# EAGLE schematic M466-compressor-limiter (EAGLE 7.2.0)
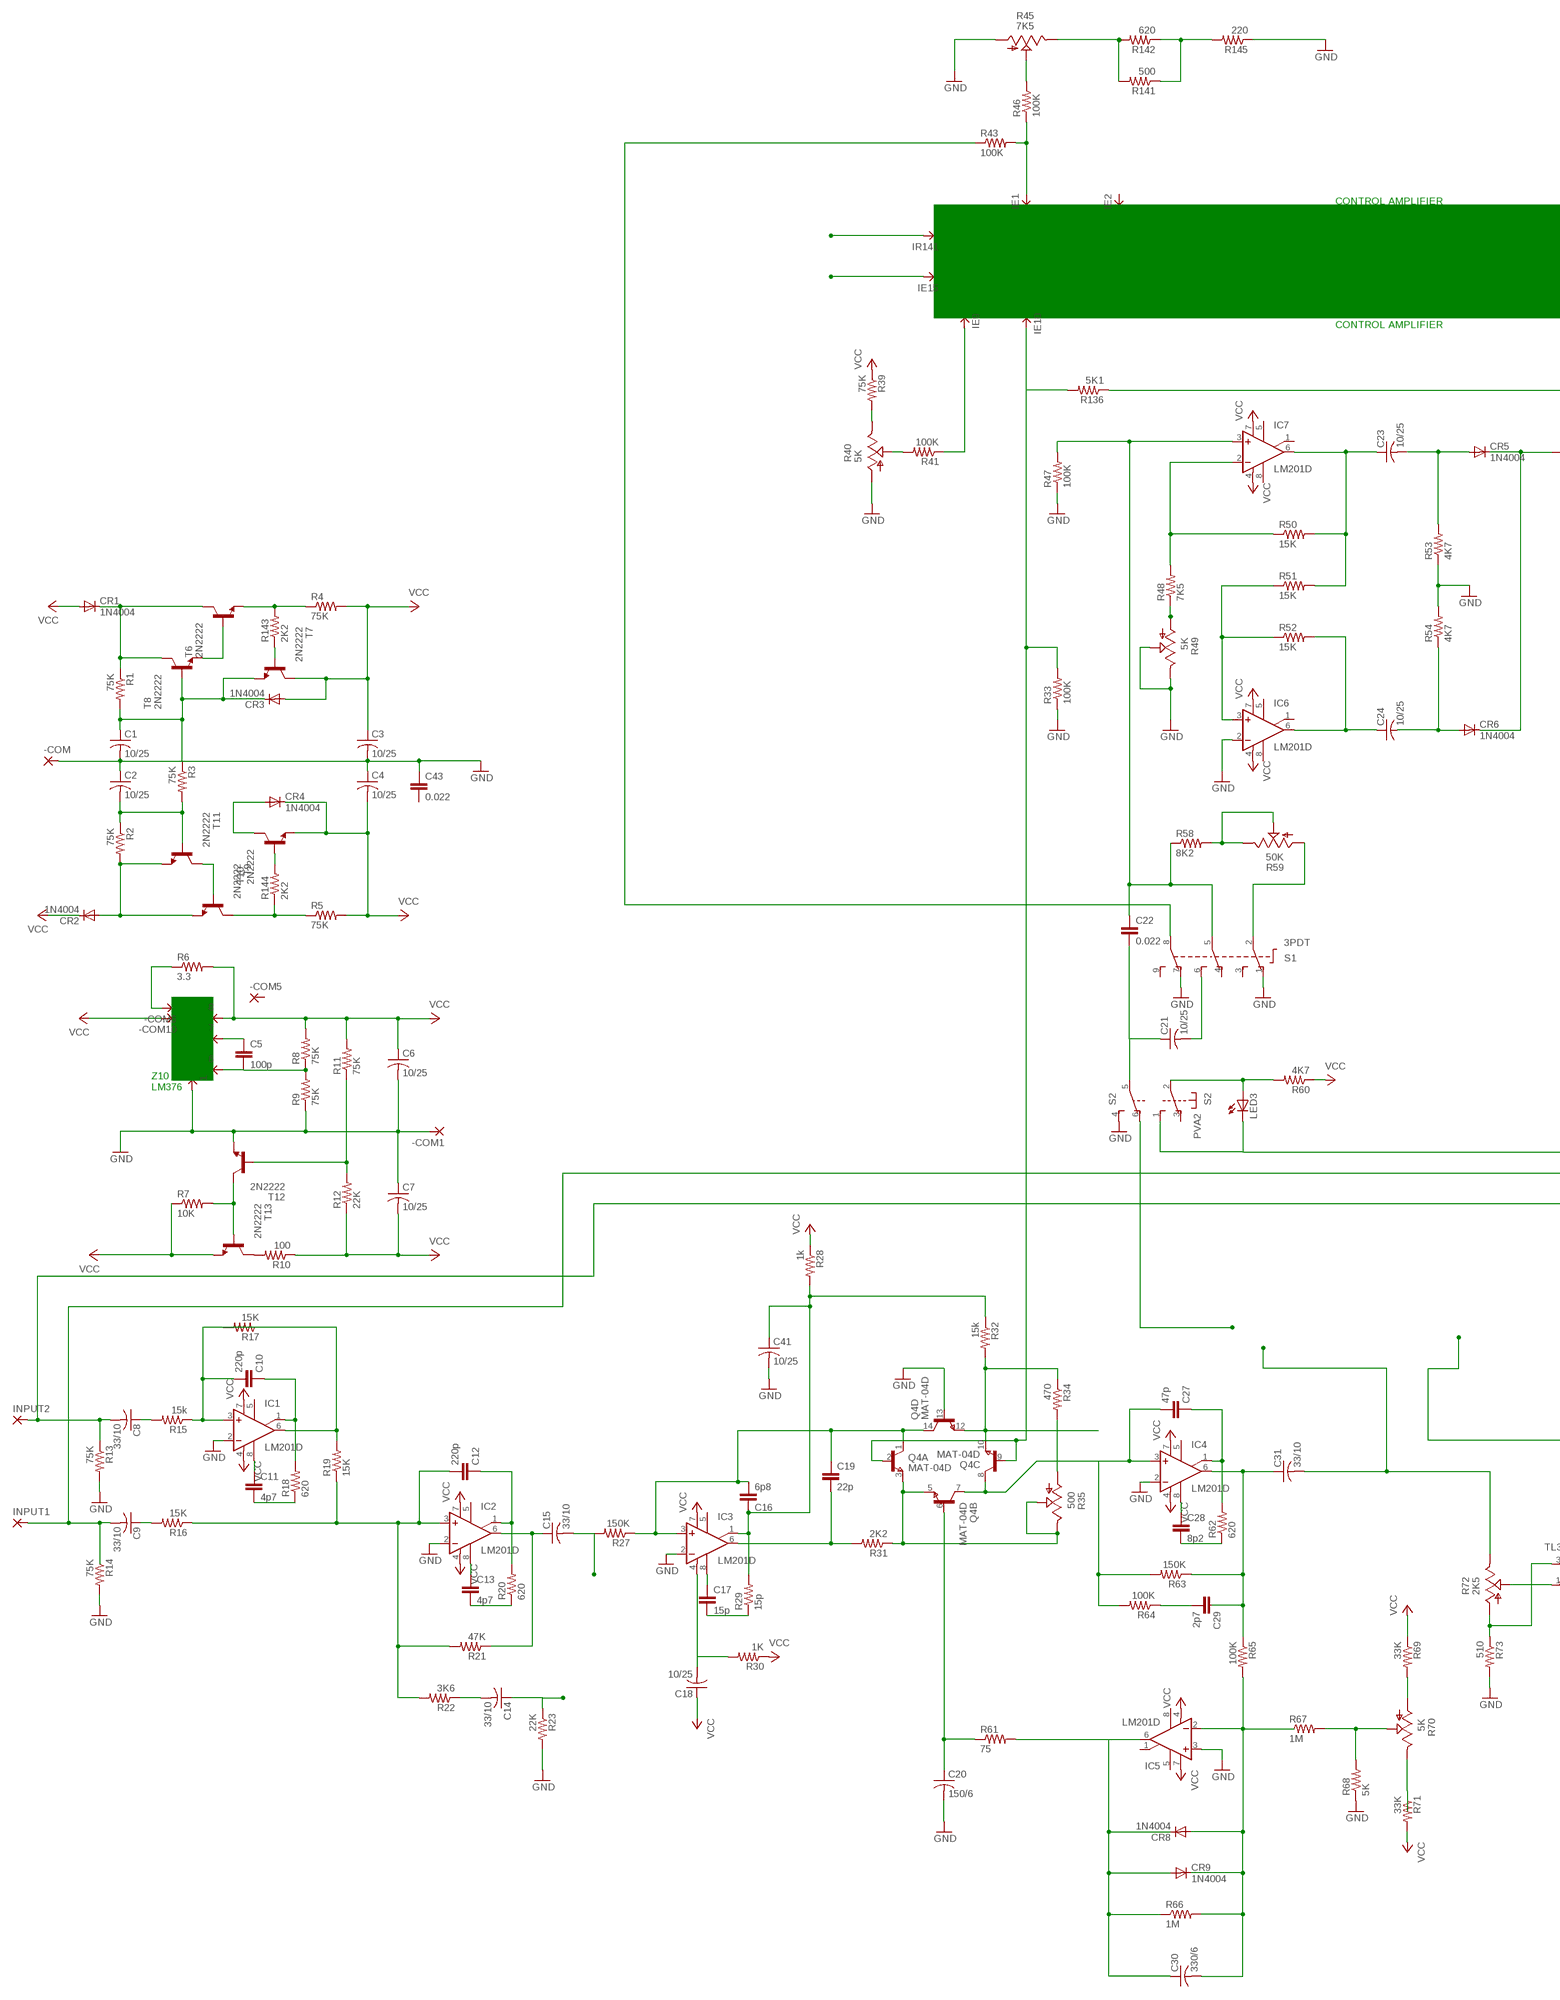
[diagram p0: schematic, sheet 1, part 1 of 2]
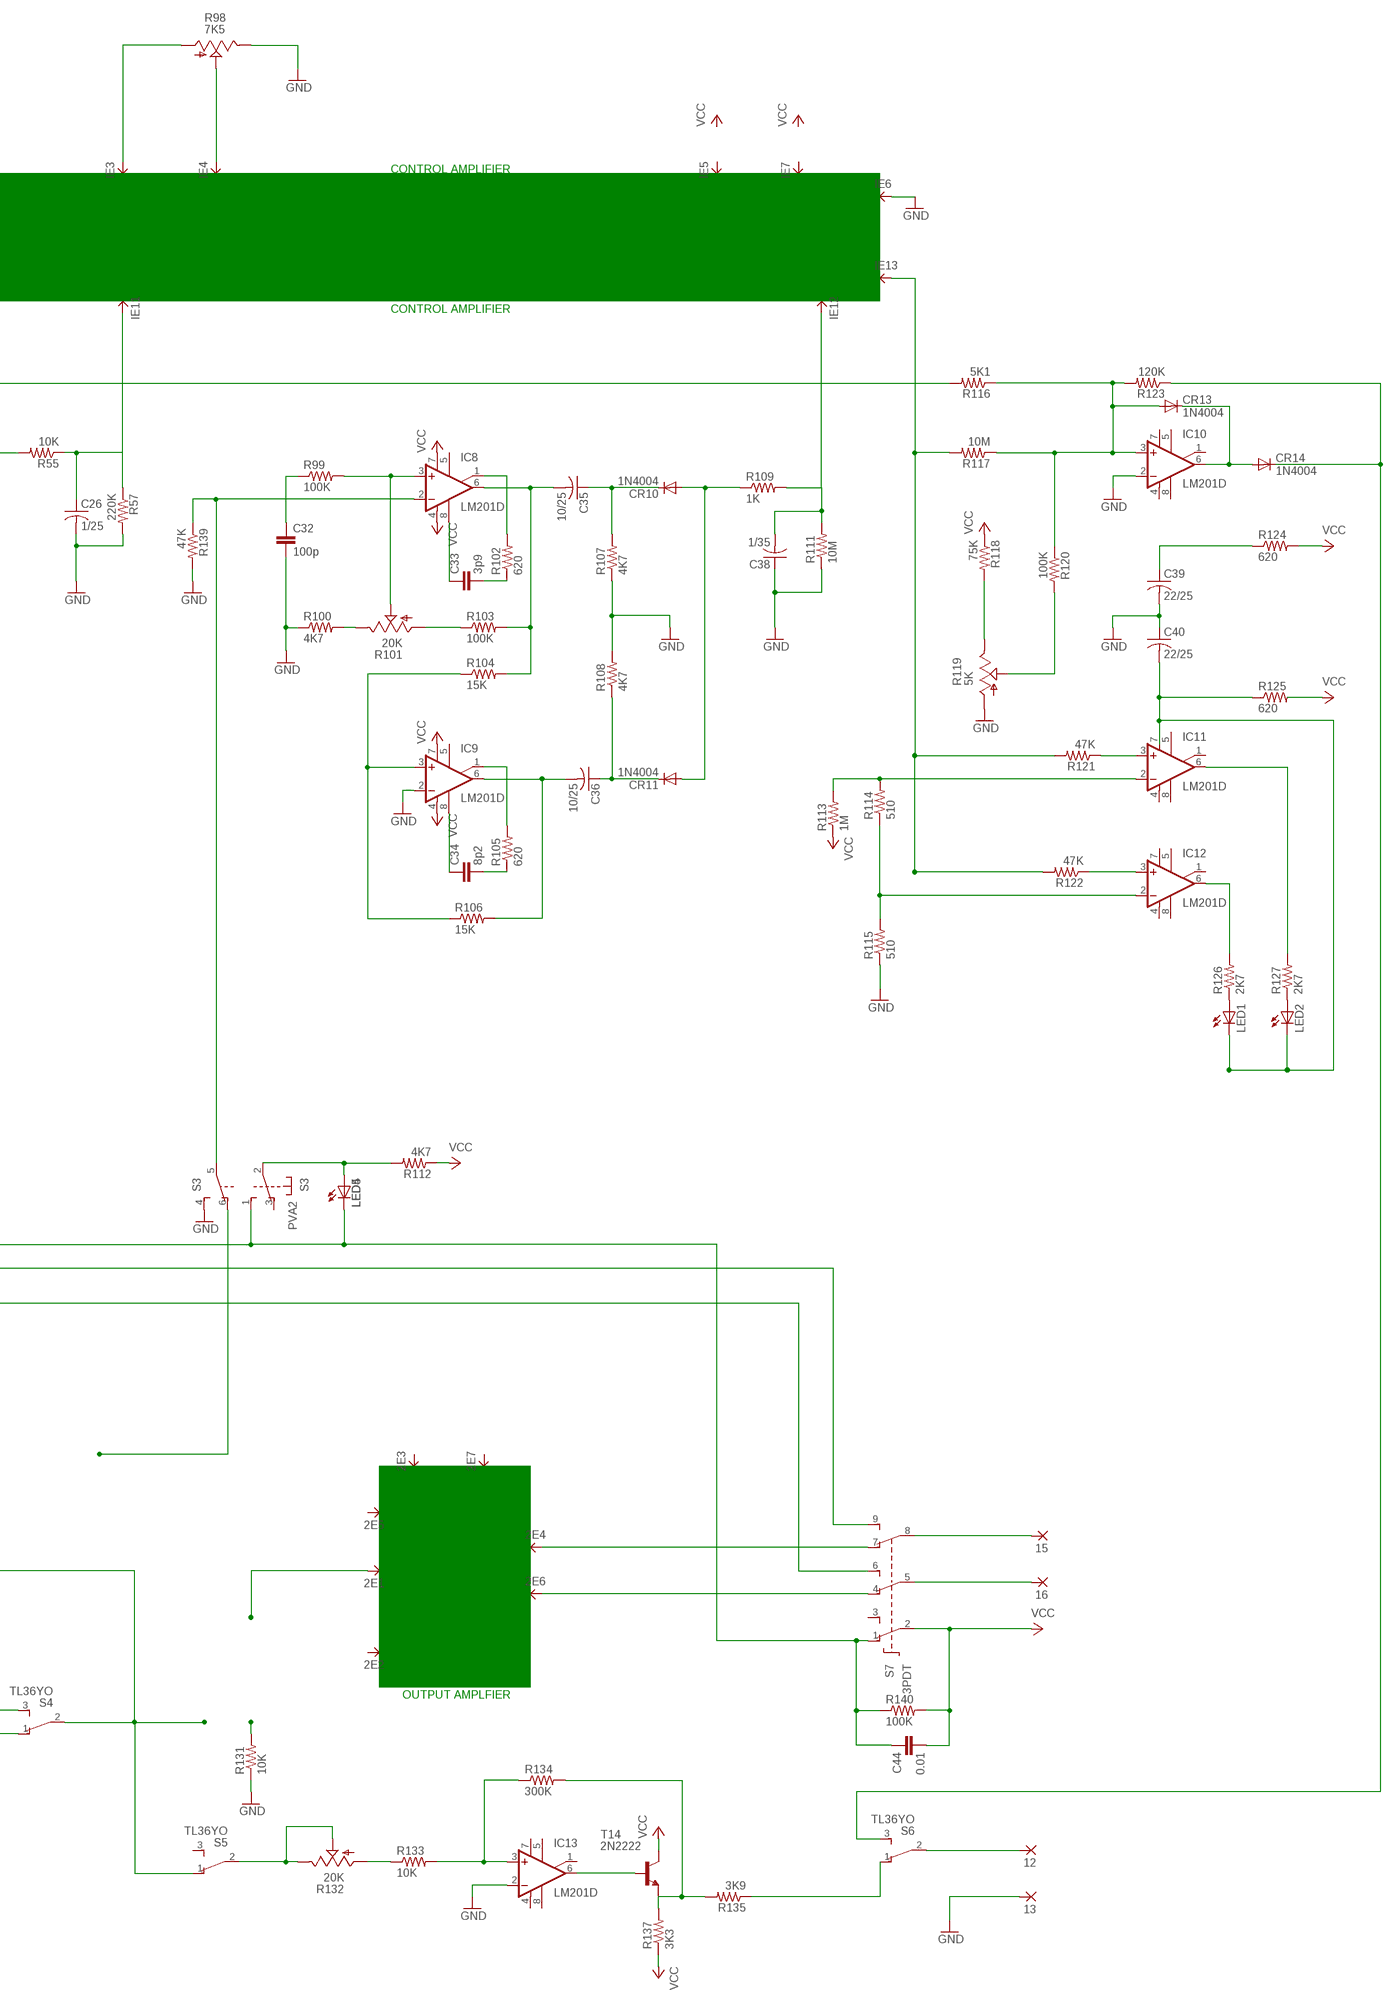
[diagram p1: schematic, sheet 1, part 2 of 2]

## Parts
1  SMD2  [SMD1,27-2,54]
2E1  SMD2  [SMD1,27-2,54]
2E2  SMD2  [SMD1,27-2,54]
2E3  SMD2  [SMD1,27-2,54]
2E4  SMD2  [SMD1,27-2,54]
2E5  SMD2  [SMD1,27-2,54]
2E6  SMD2  [SMD1,27-2,54]
2E7  SMD2  [SMD1,27-2,54]
6  SMD2  [SMD1,27-2,54]
7  SMD2  [SMD1,27-2,54]
8  SMD2  [SMD1,27-2,54]
12  SMD2  [SMD1,27-2,54]
13  SMD2  [SMD1,27-2,54]
15  SMD2  [SMD1,27-2,54]
16  SMD2  [SMD1,27-2,54]
-COM  SMD2  [SMD1,27-2,54]
-COM1  SMD2  [SMD1,27-2,54]
-COM5  SMD2  [SMD1,27-2,54]
-COM6  SMD2  [SMD1,27-2,54]
-COM10  SMD2  [SMD1,27-2,54]
C1  10/25  C-USC0805  [C0805]
C2  10/25  C-USC0805  [C0805]
C3  10/25  C-USC0805  [C0805]
C4  10/25  C-USC0805  [C0805]
C5  100p  C2.5/5  [C2.5-5]
C6  10/25  C-USC0805  [C0805]
C7  10/25  C-USC0805  [C0805]
C8  33/10  C-USC0805  [C0805]
C9  33/10  C-USC0805  [C0805]
C10  220p  C2.5/5  [C2.5-5]
C11  4p7  C2.5/5  [C2.5-5]
C12  220p  C2.5/5  [C2.5-5]
C13  4p7  C2.5/5  [C2.5-5]
C14  33/10  C-USC0805  [C0805]
C15  33/10  C-USC0805  [C0805]
C16  6p8  C2.5/5  [C2.5-5]
C17  15p  C2.5/5  [C2.5-5]
C18  10/25  C-USC0805  [C0805]
C19  22p  C2.5/5  [C2.5-5]
C20  150/6  C-USC0805  [C0805]
C21  10/25  C-USC0805  [C0805]
C22  0.022  C2.5/5  [C2.5-5]
C23  10/25  C-USC0805  [C0805]
C24  10/25  C-USC0805  [C0805]
C26  1/25  C-USC0805  [C0805]
C27  47p  C2.5/5  [C2.5-5]
C28  8p2  C2.5/5  [C2.5-5]
C29  2p7  C2.5/5  [C2.5-5]
C30  330/6  C-USC0805  [C0805]
C31  33/10  C-USC0805  [C0805]
C32  100p  C2.5/5  [C2.5-5]
C33  3p9  C2.5/5  [C2.5-5]
C34  8p2  C2.5/5  [C2.5-5]
C35  10/25  C-USC0805  [C0805]
C36  10/25  C-USC0805  [C0805]
C38  1/35  C-USC0805  [C0805]
C39  22/25  C-USC0805  [C0805]
C40  22/25  C-USC0805  [C0805]
C41  10/25  C-USC0805  [C0805]
C43  0.022  C2.5/5  [C2.5-5]
C44  0.01  C2.5/5  [C2.5-5]
CR1  1N4004  [DO41-10]
CR2  1N4004  [DO41-10]
CR3  1N4004  [DO41-10]
CR4  1N4004  [DO41-10]
CR5  1N4004  [DO41-10]
CR6  1N4004  [DO41-10]
CR8  1N4004  [DO41-10]
CR9  1N4004  [DO41-10]
CR10  1N4004  [DO41-10]
CR11  1N4004  [DO41-10]
CR13  1N4004  [DO41-10]
CR14  1N4004  [DO41-10]
IC1  LM201D  [SO08]
IC2  LM201D  [SO08]
IC3  LM201D  [SO08]
IC4  LM201D  [SO08]
IC5  LM201D  [SO08]
IC6  LM201D  [SO08]
IC7  LM201D  [SO08]
IC8  LM201D  [SO08]
IC9  LM201D  [SO08]
IC10  LM201D  [SO08]
IC11  LM201D  [SO08]
IC12  LM201D  [SO08]
IC13  LM201D  [SO08]
IE1  SMD2  [SMD1,27-2,54]
IE2  SMD2  [SMD1,27-2,54]
IE3  SMD2  [SMD1,27-2,54]
IE4  SMD2  [SMD1,27-2,54]
IE5  SMD2  [SMD1,27-2,54]
IE6  SMD2  [SMD1,27-2,54]
IE7  SMD2  [SMD1,27-2,54]
IE9  SMD2  [SMD1,27-2,54]
IE10  SMD2  [SMD1,27-2,54]
IE11  SMD2  [SMD1,27-2,54]
IE12  SMD2  [SMD1,27-2,54]
IE13  SMD2  [SMD1,27-2,54]
IE15  SMD2  [SMD1,27-2,54]
INPUT1  SMD2  [SMD1,27-2,54]
INPUT2  SMD2  [SMD1,27-2,54]
IR141  SMD2  [SMD1,27-2,54]
LED1  LED  [SMARTLED-TTW]
LED2  LED  [SMARTLED-TTW]
LED3  LED  [SMARTLED-TTW]
LED4  LED  [SMARTLED-TTW]
LED5  LED  [SMARTLED-TTW]
Q4  MAT-04D  [SO14]
R1  75K  R-US_R0805  [R0805]
R2  75K  R-US_R0805  [R0805]
R3  75K  R-US_R0805  [R0805]
R4  75K  R-US_R0805  [R0805]
R5  75K  R-US_R0805  [R0805]
R6  3.3  R-US_R0805  [R0805]
R7  10K  R-US_R0805  [R0805]
R8  75K  R-US_R0805  [R0805]
R9  75K  R-US_R0805  [R0805]
R10  100  R-US_R0805  [R0805]
R11  75K  R-US_R0805  [R0805]
R12  22K  R-US_R0805  [R0805]
R13  75K  R-US_R0805  [R0805]
R14  75K  R-US_R0805  [R0805]
R15  15k  R-US_R0805  [R0805]
R16  15K  R-US_R0805  [R0805]
R17  15K  R-US_R0805  [R0805]
R18  620  R-US_R0805  [R0805]
R19  15K  R-US_R0805  [R0805]
R20  620  R-US_R0805  [R0805]
R21  47K  R-US_R0805  [R0805]
R22  3K6  R-US_R0805  [R0805]
R23  22K  R-US_R0805  [R0805]
R27  150K  R-US_R0805  [R0805]
R28  1k  R-US_R0805  [R0805]
R29  15p  R-US_R0805  [R0805]
R30  1K  R-US_R0805  [R0805]
R31  2K2  R-US_R0805  [R0805]
R32  15k  R-US_R0805  [R0805]
R33  100K  R-US_R0805  [R0805]
R34  470  R-US_R0805  [R0805]
R35  500  TRIM_US-3223G  [3223G]
R39  75K  R-US_R0805  [R0805]
R40  5K  TRIM_US-3223G  [3223G]
R41  100K  R-US_R0805  [R0805]
R43  100K  R-US_R0805  [R0805]
R45  7K5  TRIM_US-3223G  [3223G]
R46  100K  R-US_R0805  [R0805]
R47  100K  R-US_R0805  [R0805]
R48  7K5  R-US_R0805  [R0805]
R49  5K  TRIM_US-3223G  [3223G]
R50  15K  R-US_R0805  [R0805]
R51  15K  R-US_R0805  [R0805]
R52  15K  R-US_R0805  [R0805]
R53  4K7  R-US_R0805  [R0805]
R54  4K7  R-US_R0805  [R0805]
R55  10K  R-US_R0805  [R0805]
R57  220K  R-US_R0805  [R0805]
R58  8K2  R-US_R0805  [R0805]
R59  50K  TRIM_US-3223G  [3223G]
R60  4K7  R-US_R0805  [R0805]
R61  75  R-US_R0805  [R0805]
R62  620  R-US_R0805  [R0805]
R63  150K  R-US_R0805  [R0805]
R64  100K  R-US_R0805  [R0805]
R65  100K  R-US_R0805  [R0805]
R66  1M  R-US_R0805  [R0805]
R67  1M  R-US_R0805  [R0805]
R68  5K  R-US_R0805  [R0805]
R69  33K  R-US_R0805  [R0805]
R70  5K  TRIM_US-3223G  [3223G]
R71  33K  R-US_R0805  [R0805]
R72  2K5  TRIM_US-3223G  [3223G]
R73  510  R-US_R0805  [R0805]
R98  7K5  TRIM_US-3223G  [3223G]
R99  100K  R-US_R0805  [R0805]
R100  4K7  R-US_R0805  [R0805]
R101  20K  TRIM_US-3223G  [3223G]
R102  620  R-US_R0805  [R0805]
R103  100K  R-US_R0805  [R0805]
R104  15K  R-US_R0805  [R0805]
R105  620  R-US_R0805  [R0805]
R106  15K  R-US_R0805  [R0805]
R107  4K7  R-US_R0805  [R0805]
R108  4K7  R-US_R0805  [R0805]
R109  1K  R-US_R0805  [R0805]
R111  10M  R-US_R0805  [R0805]
R112  4K7  R-US_R0805  [R0805]
R113  1M  R-US_R0805  [R0805]
R114  510  R-US_R0805  [R0805]
R115  510  R-US_R0805  [R0805]
R116  5K1  R-US_R0805  [R0805]
R117  10M  R-US_R0805  [R0805]
R118  75K  R-US_R0805  [R0805]
R119  5K  TRIM_US-3223G  [3223G]
R120  100K  R-US_R0805  [R0805]
R121  47K  R-US_R0805  [R0805]
R122  47K  R-US_R0805  [R0805]
R123  120K  R-US_R0805  [R0805]
R124  620  R-US_R0805  [R0805]
R125  620  R-US_R0805  [R0805]
R126  2K7  R-US_R0805  [R0805]
R127  2K7  R-US_R0805  [R0805]
R131  10K  R-US_R0805  [R0805]
R132  20K  TRIM_US-3223G  [3223G]
R133  10K  R-US_R0805  [R0805]
R134  300K  R-US_R0805  [R0805]
R135  3K9  R-US_R0805  [R0805]
R136  5K1  R-US_R0805  [R0805]
R137  3K3  R-US_R0805  [R0805]
R139  47K  R-US_R0805  [R0805]
R140  100K  R-US_R0805  [R0805]
R141  500  R-US_R0805  [R0805]
R142  620  R-US_R0805  [R0805]
R143  2K2  R-US_R0805  [R0805]
R144  2K2  R-US_R0805  [R0805]
R145  220  R-US_R0805  [R0805]
S1  3PDT  [3PDT]
S2  PVA2  [PVA2F]
S3  PVA2  [PVA2F]
S4  TL36YO  [TL3XYO]
S5  TL36YO  [TL3XYO]
S6  TL36YO  [TL3XYO]
S7  3PDT  [3PDT]
T6  2N2222  [TO92-EBC-OVAL]
T7  2N2222  [TO92-EBC-OVAL]
T8  2N2222  [TO92-EBC-OVAL]
T9  2N2222  [TO92-EBC-OVAL]
T10  2N2222  [TO92-EBC-OVAL]
T11  2N2222  [TO92-EBC-OVAL]
T12  2N2222  [TO92-EBC-OVAL]
T13  2N2222  [TO92-EBC-OVAL]
T14  2N2222  [TO92-EBC-OVAL]

## Nets
7: 7.1(P) C5.1
GND: 13.1(P) -COM.1(P) C1.2 C2.1 C3.2 C4.1 C20.2 C26.2 C32.2 C38.1 C39.2 C40.1 C41.2 C43.1 IC1.2(-IN) IC2.2(-IN) IC3.2(-IN) IC4.2(-IN) IC5.3(+IN) IC6.2(-IN) IC9.2(-IN) IC10.2(-IN) IC13.2(-IN) IE6.1(P) Q4.13(D:B) R13.2 R14.2 R23.2 R33.1 R40.1(A) R45.1(A) R47.1 R49.2(S) R49.3(E) R53.1 R54.2 R57.2 R68.1 R73.2 R98.3(E) R100.1 R107.1 R108.2 R111.1 R115.1 R119.1(A) R131.1 R139.2 R145.1 S1.1(O1) S1.7(O3) S2.4(2:S) S3.4(2:S)
IE1: IE1.1(P) R43.2 R46.1
N$1: C11.1 IC1.8(CMP)
N$2: C10.1 IC1.1(ON/CMP) R18.2
N$3: C11.2 R18.1
N$4: C8.2 INPUT2.1(P) R13.1 S7.6(S2)
N$5: C13.1 IC2.8(CMP)
N$6: C12.1 IC2.1(ON/CMP) R20.2
N$7: C13.2 R20.1
N$8: C12.2 IC2.3(+IN) R16.1 R19.1 R21.2 R22.2
N$9: C17.1 IC3.8(CMP)
N$10: C16.1 C41.1 IC3.1(ON/CMP) R28.2 R29.2 R32.1
N$11: C17.2 R29.1
N$12: C16.2 C19.1 IC3.3(+IN) Q4.1(A:C) Q4.14(D:C) R27.1
N$13: C8.1 R15.2
N$14: C10.2 IC1.3(+IN) IC1.6(OUT) R15.1 R17.1 R17.2 R19.2
N$15: C15.1 IC2.6(OUT) R21.1
N$16: C9.1 R16.2
N$17: C9.2 INPUT1.1(P) S7.9(S3)
N$18: C15.2 R27.2
N$19: C18.2 IC3.4(V-) R30.2
N$20: C14.1 R23.1
N$21: C14.2 R22.1
N$22: C19.2 IC3.6(OUT) R31.2
N$23: IE10.1(P) Q4.2(A:B) Q4.9(C:B) R33.2 R136.2
N$24: Q4.3(A:E) Q4.5(B:E) R31.1 R35.2(S) R35.3(E)
N$25: Q4.10(C:E) Q4.12(D:E) R32.2 R34.1
N$26: C29.2 R64.1
N$27: R34.2 R35.1(A)
N$28: C20.1 Q4.6(B:B) R61.1
N$29: R144.2 T10.B
N$30: C28.1 IC4.8(CMP)
N$31: C27.1 IC4.1(ON/CMP) R62.2
N$32: C28.2 R62.1
N$33: C27.2 IC4.3(+IN) Q4.7(B:C) Q4.8(C:C) R63.2 R64.2
N$34: C31.1 IC4.6(OUT) R63.1 R65.1
N$35: C30.2 CR8.A CR9.C IC5.2(-IN) R65.2 R66.2
N$36: C30.1 CR8.C CR9.A IC5.6(OUT) R61.2 R66.1
N$37: S2.6(2:O)
N$38: R69.2 R70.1(A)
N$39: R70.3(E) R71.1
N$40: R67.2 R68.2 R70.2(S)
N$41: -COM6.1(P) R6.1
N$42: CR4.A T10.C
N$43: R143.1 T7.B
N$44: CR1.C R1.1 T6.C T8.C
N$45: T6.B T8.E
N$46: C1.1 CR3.C R1.2 R3.1 T7.E T8.B
N$47: T9.B T11.C
N$48: CR2.A R2.2 T9.E T11.E
N$49: R58.2 R59.2(S) R59.3(E)
N$50: R59.1(A) S1.2(P1)
N$51: CR14.C R123.1 S6.3(S)
N$52: R4.1 R143.2 T6.E
N$53: C2.2 R2.1 R3.2 T11.B
N$54: R5.1 R144.1 T9.C
N$55: R45.2(S) R46.2
N$56: 6.1(P) C5.2 R8.1 R9.2
N$57: S3.6(2:O)
N$58: R7.2 T12.C T13.B
N$59: 1.1(P) -COM1.1(P) C6.2 C7.1 R9.1 T12.E
N$60: R11.1 R12.2 T12.B
N$61: 2E1.1(P)
N$62: R10.2 T13.C
N$63: R131.2
N$64: R43.1 S1.8(P3)
N$65: C21.2 S1.6(S2)
N$66: C21.1 C22.2 S2.5(2:P)
N$67: R48.1 R49.1(A)
N$68: IC7.2(-IN) R48.2 R50.1
N$69: IC6.3(+IN) R51.1 R52.1
N$70: C23.1 IC7.6(OUT) R50.2 R51.2
N$71: C24.1 IC6.6(OUT) R52.2
N$72: C23.2 CR5.A R53.2
N$73: C26.1 IE11.1(P) R55.1 R57.1
N$74: CR6.A R54.1
N$75: CR5.C CR6.C R55.2
N$76: R116.2 R136.1
N$77: IC8.2(-IN) R139.1 S3.5(2:P)
N$78: C33.1 IC8.8(CMP)
N$79: C33.2 R102.1
N$80: IC8.1(ON/CMP) R102.2
N$81: C34.1 IC9.8(CMP)
N$82: C34.2 R105.1
N$83: IC9.1(ON/CMP) R105.2
N$84: C32.1 R99.1
N$85: IC8.3(+IN) R99.2 R101.2(S)
N$86: R101.1(A) R103.1
N$87: R100.2 R101.3(E)
N$88: C35.2 IC8.6(OUT) R103.2 R104.2
N$89: IC9.3(+IN) R104.1 R106.1
N$90: C36.2 IC9.6(OUT) R106.2
N$91: C36.1 CR11.C R108.1
N$92: C35.1 CR10.C R107.2
N$93: CR10.A CR11.A R109.1
N$94: C38.2 IE12.1(P) R109.2 R111.2
N$95: R39.2 R40.3(E)
N$96: R40.2(S) R41.2
N$97: IE9.1(P) R41.1
N$98: IE3.1(P) R98.1(A)
N$99: R141.1 R142.1 R145.2
N$100: R45.3(E) R141.2 R142.2
N$101: IE4.1(P) R98.2(S)
N$102: C22.1 IC7.3(+IN) R47.2 R58.1 S1.5(P2)
N$103: C39.1 R124.1
N$104: IE13.1(P) R117.2 R121.2 R122.2
N$105: IC11.3(+IN) R121.1
N$106: IC11.2(-IN) R113.2 R114.2
N$107: IC12.2(-IN) R114.1 R115.2
N$108: CR13.C CR14.A IC10.6(OUT)
N$109: IC12.3(+IN) R122.1
N$110: R119.2(S) R120.2
N$111: C44.1 LED3.C@1(C) LED4.C@1(C) LED5.C@1(C) R140.1 S2.1(1:S) S3.1(1:S) S7.1(O1)
N$112: R118.2 R119.3(E)
N$113: CR13.A IC10.3(+IN) R116.1 R117.1 R120.1 R123.2
N$114: IC11.6(OUT) R127.2
N$115: IC12.6(OUT) R126.2
N$116: LED1.A@1(A) R126.1
N$117: LED2.A@1(A) R127.1
N$118: C31.2 R72.3(E)
N$119: LED4.A@1(A) LED5.A@1(A) R112.2 S3.2(1:P)
N$120: LED3.A@1(A) R60.2 S2.2(1:P)
N$121: 15.1(P) S7.8(P3)
N$122: R72.1(A) R73.1 S4.3(S)
N$123: IC13.3(+IN) R133.2 R134.1
N$124: R72.2(S) S4.1(O)
N$125: S4.2(P) S5.1(O)
N$126: R132.1(A) R133.1
N$127: R132.2(S) R132.3(E) S5.2(P)
N$128: R135.1 S6.1(O)
N$129: 2E6.1(P) S7.4(O2)
N$130: IC13.6(OUT) T14.B
N$131: R134.2 R135.2 R137.2 T14.E
N$132: 2E4.1(P) S7.7(O3)
N$133: 16.1(P) S7.5(P2)
N$134: C40.2 LED1.C@1(C) LED2.C@1(C) R125.1
N$135: 12.1(P) S6.2(P)
N$136: IE15.1(P)
N$137: IR141.1(P)
VCC: 8.1(P) -COM10.1(P) C3.1 C4.2 C6.1 C7.2 C18.1 C44.2 CR1.A CR2.C CR3.A CR4.C IC1.4(V-) IC1.7(V+) IC2.4(V-) IC2.7(V+) IC3.7(V+) IC4.4(V-) IC4.7(V+) IC5.4(V-) IC5.7(V+) IC6.4(V-) IC6.7(V+) IC7.4(V-) IC7.7(V+) IC8.4(V-) IC8.7(V+) IC9.4(V-) IC9.7(V+) R4.2 R5.2 R6.2 R7.1 R8.2 R10.1 R11.2 R12.1 R28.1 R30.1 R39.1 R60.1 R69.1 R71.2 R112.1 R113.1 R118.1 R124.2 R137.1 R140.2 S7.2(P1) T7.C T10.E T13.E T14.C
Unconnected: 2E2.1(P) 2E3.1(P) 2E5.1(P) 2E7.1(P) -COM5.1(P) C24.2 C29.1 C43.2 IC1.5(ON) IC2.5(ON) IC3.5(ON) IC4.5(ON) IC5.1(ON/CMP) IC5.5(ON) IC5.8(CMP) IC6.1(ON/CMP) IC6.5(ON) IC6.8(CMP) IC7.1(ON/CMP) IC7.5(ON) IC7.8(CMP) IC8.5(ON) IC9.5(ON) IC10.1(ON/CMP) IC10.5(ON) IC10.8(CMP) IC11.1(ON/CMP) IC11.5(ON) IC11.8(CMP) IC12.1(ON/CMP) IC12.5(ON) IC12.8(CMP) IC13.1(ON/CMP) IC13.5(ON) IC13.8(CMP) IE2.1(P) IE5.1(P) IE7.1(P) R14.1 R67.1 R125.2 S1.3(S1) S1.4(O2) S1.9(S3) S2.3(1:O) S3.3(1:O) S5.3(S) S7.3(S1)

## Notes on the sheet
- CONTROL AMPLIFIER | CONTROL AMPLIFIER
- DSFSDF
- CONTROL AMPLIFIER
- CONTROL AMPLIFIER | CONTROL AMPLIFIER
- Z10 | Z10 | Z10 | Z10 | Z10
- Z10
- Z10
  LM376
- OUTPUT AMPLFIER

## Power pins joined to a net without a drawn wire
V+: IC10.7(V+) IC11.7(V+) IC12.7(V+) IC13.7(V+)
V-: IC10.4(V-) IC11.4(V-) IC12.4(V-) IC13.4(V-)

## Library data of the parts
1 2E1-2E7 6-8 12 13 15 16 -COM -COM1 -COM5 -COM6 -COM10 IE1-IE7 IE9-IE13 IE15 INPUT1 INPUT2 IR141 = wirepad:SMD2: SMD PAD
C1-C4 C6-C9 C14 C15 C18 C20 C21 C23 C24 C26 C30 C31 C35 C36 C38-C41 = adafruit:C-US: CAPACITOR, American symbol
C5 C10-C13 C16 C17 C19 C22 C27-C29 C32-C34 C43 C44 = capacitor-wima:C: CAPACITOR naming: grid - package width
CR1-CR6 CR8-CR11 CR13 CR14 = adafruit:1N4004: DIODE General purpose 1N400x type rectifier (With bigger pads) http://www.ladyada.net/library/pcb/eaglelibrary.html
IC1-IC13 = linear:LM201: OP AMP
LED1-LED5 = adafruit:LED: LED OSRAM: - CHIPLED LG R971, LG N971, LY N971, LG Q971, LY Q971, LO R971, LY R971 LH N974, LH R974 LS Q976, LO Q976, LY Q976 LO Q996 - Hyper CHIPLED LW Q18S LB Q993, LB Q99A, LB R99A - SideLED LS A670, LO A670, LY A670, LG A670, LP A670 LB A673, LV A673, LT A673, LW A673 LH A674 LY A675 LS A676, LA A676, LO A676, LY A676, LW A676 LS A679, LY A679, LG A679 - Hyper Micro SIDELED® LS Y876, LA Y876, LO Y876, LY Y876 LT Y87S - SmartLED LW L88C, LW L88S LB L89C, LB L89S, LG L890 LS L89K, LO L89K, LY L89K LS L896, LA L896, LO L896, LY L896 - TOPLED LS T670, LO T670, LY T670, LG T670, LP T670 LSG T670, LSP T670, LSY T670, LOP T670, LYG T670 LG T671, LOG T671, LSG T671 LB T673, LV T673, LT T673, LW T673 LH T674 LS T676, LA T676, LO T676, LY T676, LB T676, LH T676, LSB T676, LW T676 LB T67C, LV T67C, LT T67C, LS T67K, LO T67K, LY T67K, LW E67C LS E67B, LA E67B, LO E67B, LY E67B, LB E67C, LV E67C, LT E67C LW T67C LS T679, LY T679, LG T679 LS T770, LO T770, LY T770, LG T770, LP T770 LB T773, LV T773, LT T773, LW T773 LH T774 LS E675, LA E675, LY E675, LS T675 LS T776, LA T776, LO T776, LY T776, LB T776 LHGB T686 LT T68C, LB T68C - Hyper Mini TOPLED® LB M676 - Mini TOPLED Santana® LG M470 LS M47K, LO M47K, LY M47K Source: http://www.osram.convergy.de/
Q4 = linear:MAT-04: Quad TRANSISTOR
R1-R23 R27-R34 R39 R41 R43 R46-R48 R50-R55 R57 R58 R60-R69 R71 R73 R99 R100 R102-R109 R111-R118 R120-R127 R131 R133-R137 R139-R145 = adafruit:R-US_: RESISTOR, American symbol
R35 R40 R45 R49 R59 R70 R72 R98 R101 R119 R132 = pot:TRIM_US-: POTENTIOMETER
S1 S7 = switch:3PDT: 3PDT 9 pin footswitch SF17020F-0302-21R-L Source: 3PDT.jpg
S2 S3 = switch-misc:PVA2: ITT SWITCH
S4-S6 = switch:TL36YO: TINY SWITCH ON - ON Source: http://www2.produktinfo.conrad.com/datenblaetter/700000-724999/705152-da-01-de-Subminiaturschalter_TL_36YO.pdf
T6-T14 = adafruit:2N2222: NPN TRANSISTOR Big oval pads